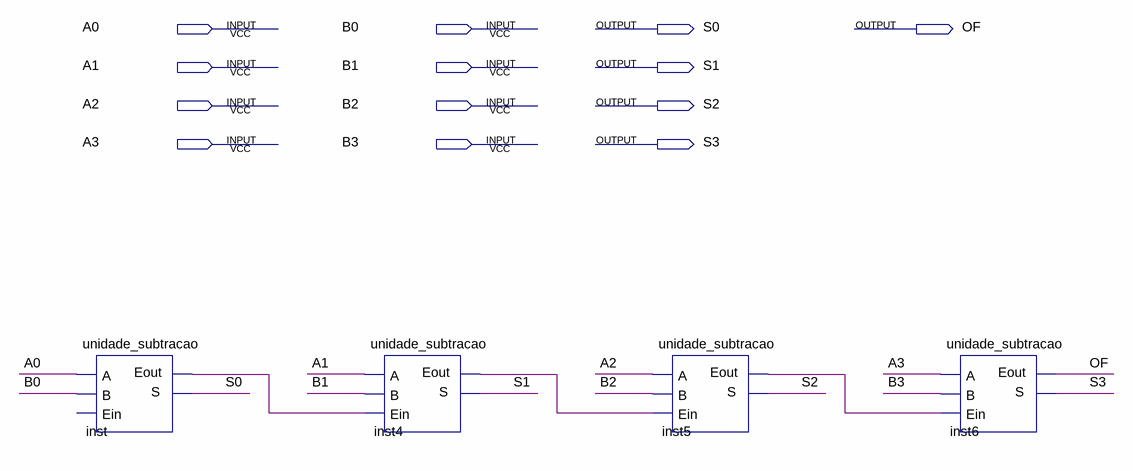
[diagram p0: schematic sheet]
// Quartus schematic subtrator.bdf as structural Verilog: 4 symbols, 13 pins
module subtrator (
  input  A0,
  input  B0,
  input  A1,
  input  B1,
  input  A2,
  input  B2,
  input  A3,
  input  B3,
  output S0,
  output OF,
  output S1,
  output S2,
  output S3
);

  wire inst4_eout, inst5_eout, inst_eout;

  unidade_subtracao inst (.A(A0), .B(B0), .S(S0), .Eout(inst_eout));  // open: Ein
  unidade_subtracao inst4 (.A(A1), .B(B1), .Ein(inst_eout), .S(S1), .Eout(inst4_eout));
  unidade_subtracao inst5 (.A(A2), .B(B2), .Ein(inst4_eout), .S(S2), .Eout(inst5_eout));
  unidade_subtracao inst6 (.A(A3), .B(B3), .Ein(inst5_eout), .S(S3), .Eout(OF));
endmodule
